# EAGLE design display (EAGLE 9.6.2)
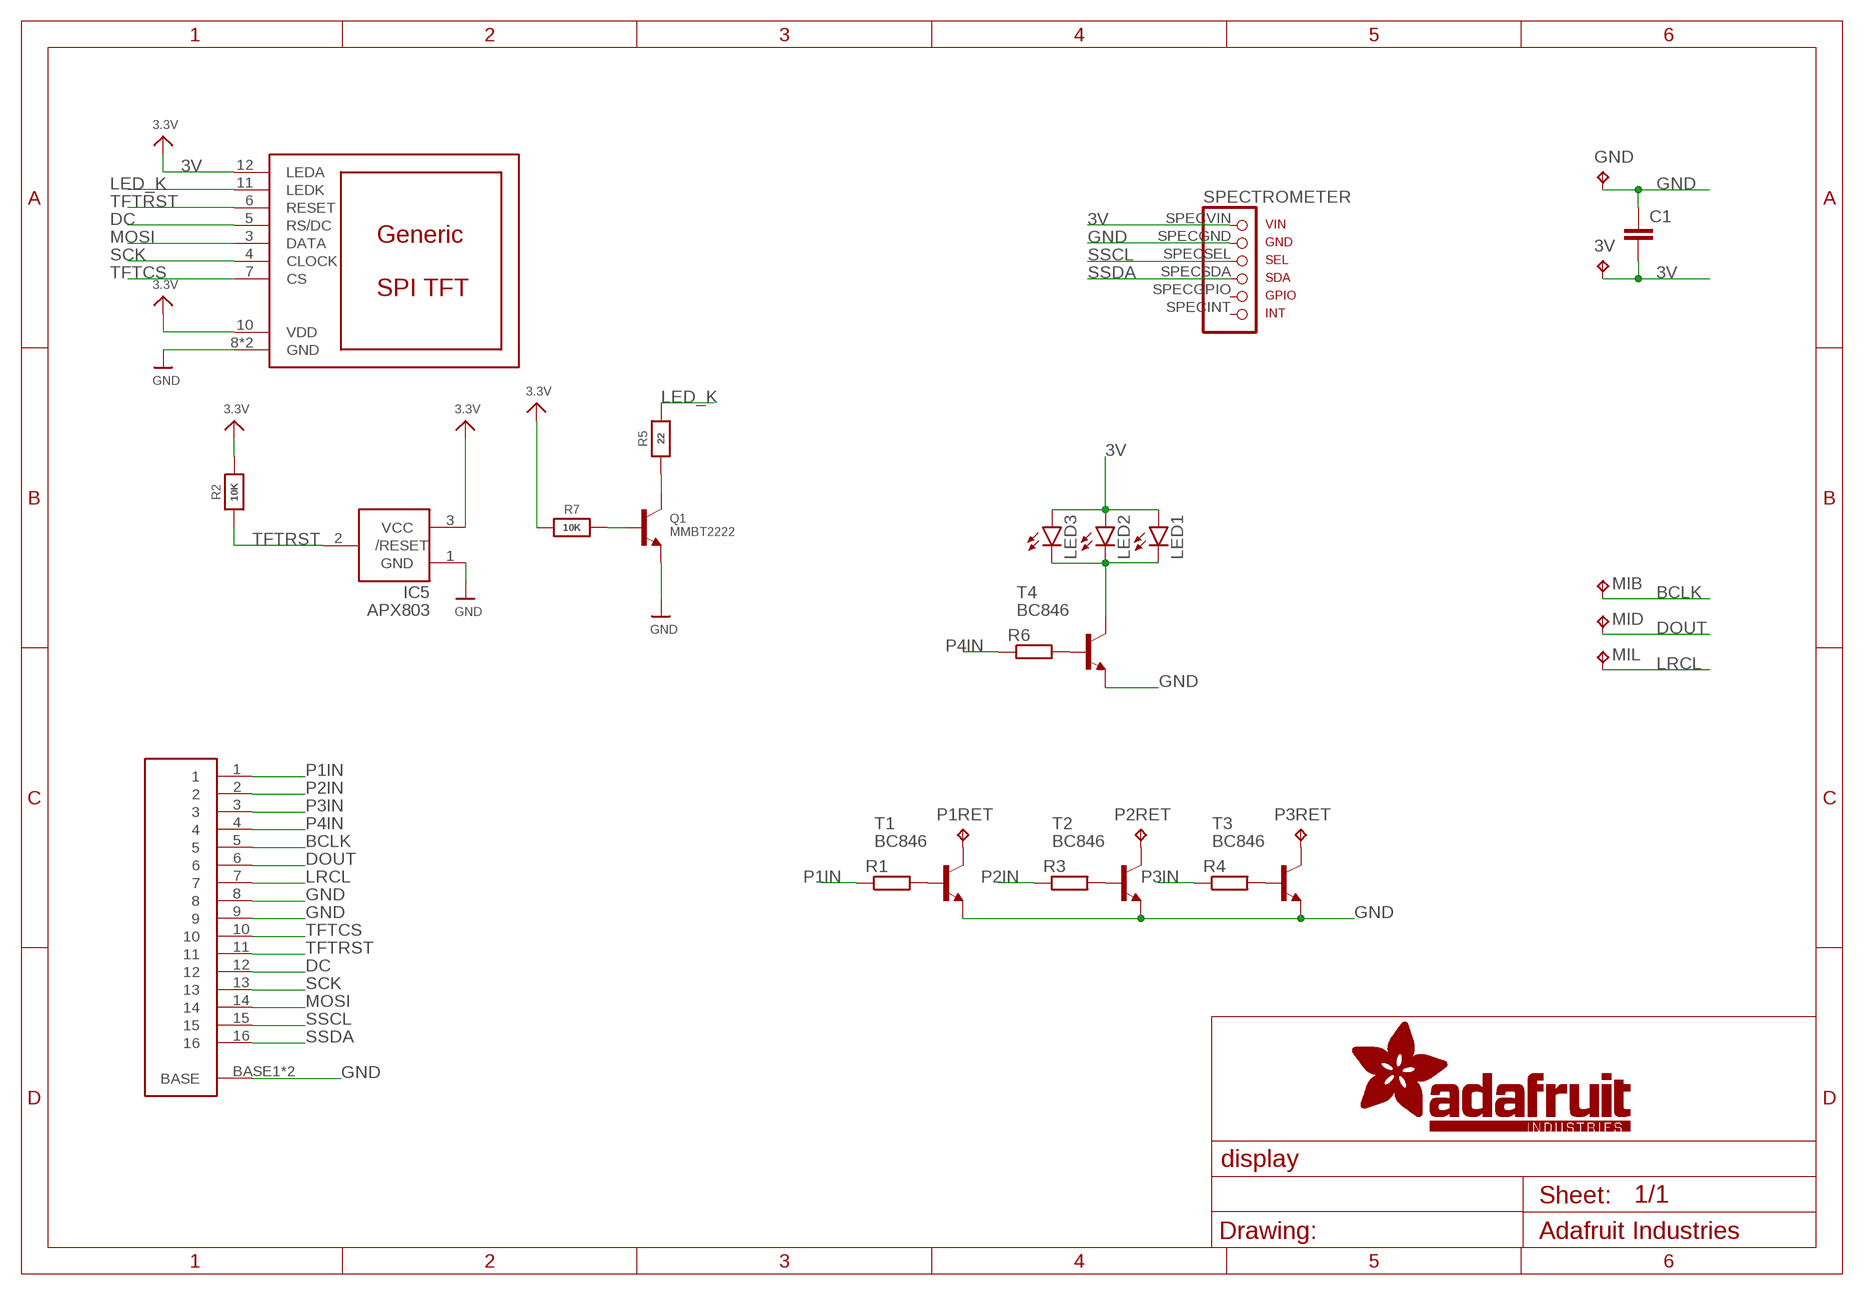
[diagram p0: schematic, sheet 1]

## Parts
3V  TPTP20R  [TP20R]
C1  C-EUC0805  [C0805]
DISP1  DISP_LCD_GENERIC_SPI_1.14IN_240X135_WRAPUNDER  [TFT_1.14IN_240X135_WRAPUNDER]
GND  TPTP20R  [TP20R]
IC5  APX803  AXP083-SAG  [SOT23]
LED1  LED3MM  [LED3MM]
LED2  LED3MM  [LED3MM]
LED3  LED3MM  [LED3MM]
MIB  TPTP10R  [TP10R]
MID  TPTP10R  [TP10R]
MIL  TPTP10R  [TP10R]
P1RET  TPTP10R  [TP10R]
P2RET  TPTP10R  [TP10R]
P3RET  TPTP10R  [TP10R]
Q1  MMBT2222  TRANSISTOR_NPNWIDE  [SOT23-WIDE]
R1  R-EU_R0805  [R0805]
R2  10K  RESISTOR_0603_NOOUT  [0603-NO]
R3  R-EU_R0805  [R0805]
R4  R-EU_R0805  [R0805]
R5  22  RESISTOR_0603_NOOUT  [0603-NO]
R6  R-EU_R0805  [R0805]
R7  10K  RESISTOR_0603_NOOUT  [0603-NO]
T1  BC846  [SOT23]
T2  BC846  [SOT23]
T3  BC846  [SOT23]
T4  BC846  [SOT23]
U$2  SPECTROMETER  [SPECTROMETER]
U$3  16PINFFC  [16PINFFC]

## Nets
3V [thick]: 3V.TP C1.2 DISP1.10(VDD) DISP1.12(LEDA) IC5.3(VCC) LED1.A LED2.A LED3.A R2.2 R7.1 U$2.SPECVIN ; supply symbol labelled 3.3V
BCLK: MIB.TP U$3.5
DC: DISP1.5(RS/DC) U$3.12
DOUT: MID.TP U$3.6
GND [thick]: C1.1 DISP1.8(GND) DISP1.13(GND) GND.TP IC5.1(GND) Q1.2(E) T1.2(E) T2.2(E) T3.2(E) T4.2(E) U$2.SPECGND U$3.8 U$3.9 U$3.BASE1(BASE) U$3.BASE2(BASE)
LED_K: DISP1.11(LEDK) R5.2
LRCL: MIL.TP U$3.7
MOSI: DISP1.3(DATA) U$3.14
N$1: Q1.1(B) R7.2
N$4: R1.2 T1.1(B)
N$5: Q1.3(C) R5.1
N$6: R3.2 T2.1(B)
N$7: R4.2 T3.1(B)
N$8: P1RET.TP T1.3(C)
N$9: P2RET.TP T2.3(C)
N$10: P3RET.TP T3.3(C)
N$14: R6.2 T4.1(B)
P1IN: R1.1 U$3.1
P2IN: R3.1 U$3.2
P3IN: R4.1 U$3.3
P4IN: R6.1 U$3.4
PWM4: LED1.K(C) LED2.K(C) LED3.K(C) T4.3(C)
SCK: DISP1.4(CLOCK) U$3.13
SSCL: U$2.SPECSEL U$3.15
SSDA: U$2.SPECSDA U$3.16
TFTCS: DISP1.7(CS) U$3.10
TFTRST: DISP1.6(RESET) IC5.2(/RESET) R2.1 U$3.11
Unconnected: U$2.SPECGPIO U$2.SPECINT

## Library data of the parts
3V GND MIB MID MIL P1RET P2RET P3RET = testpad:TP: Test pad
C1 = resistor:C-EU: CAPACITOR, European symbol
DISP1 = microbuilder:DISP_LCD_GENERIC_SPI
IC5 = adafruit:AXP083
LED1-LED3 = led:LED: LED OSRAM: - CHIPLED LG R971, LG N971, LY N971, LG Q971, LY Q971, LO R971, LY R971 LH N974, LH R974 LS Q976, LO Q976, LY Q976 LO Q996 - Hyper CHIPLED LW Q18S LB Q993, LB Q99A, LB R99A - SideLED LS A670, LO A670, LY A670, LG A670, LP A670 LB A673, LV A673, LT A673, LW A673 LH A674 LY A675 LS A676, LA A676, LO A676, LY A676, LW A676 LS A679, LY A679, LG A679 - Hyper Micro SIDELED® LS Y876, LA Y876, LO Y876, LY Y876 LT Y87S - SmartLED LW L88C, LW L88S LB L89C, LB L89S, LG L890 LS L89K, LO L89K, LY L89K LS L896, LA L896, LO L896, LY L896 - TOPLED LS T670, LO T670, LY T670, LG T670, LP T670 LSG T670, LSP T670, LSY T670, LOP T670, LYG T670 LG T671, LOG T671, LSG T671 LB T673, LV T673, LT T673, LW T673 LH T674 LS T676, LA T676, LO T676, LY T676, LB T676, LH T676, LSB T676, LW T676 LB T67C, LV T67C, LT T67C, LS T67K, LO T67K, LY T67K, LW E67C LS E67B, LA E67B, LO E67B, LY E67B, LB E67C, LV E67C, LT E67C LW T67C LS T679, LY T679, LG T679 LS T770, LO T770, LY T770, LG T770, LP T770 LB T773, LV T773, LT T773, LW T773 LH T774 LS E675, LA E675, LY E675, LS T675 LS T776, LA T776, LO T776, LY T776, LB T776 LHGB T686 LT T68C, LB T68C - Hyper Mini TOPLED® LB M676 - Mini TOPLED Santana® LG M470 LS M47K, LO M47K, LY M47K Source: http://www.osram.convergy.de LUXEON: - LUMILED® LXK2-PW12-R00, LXK2-PW12-S00, LXK2-PW14-U00, LXK2-PW14-V00 LXK2-PM12-R00, LXK2-PM12-S00, LXK2-PM14-U00 LXK2-PE12-Q00, LXK2-PE12-R00, LXK2-PE12-S00, LXK2-PE14-T00, LXK2-PE14-U00 LXK2-PB12-K00, LXK2-PB12-L00, LXK2-PB12-M00, LXK2-PB14-N00, LXK2-PB14-P00, LXK2-PB14-Q00 LXK2-PR12-L00, LXK2-PR12-M00, LXK2-PR14-Q00, LXK2-PR14-R00 LXK2-PD12-Q00, LXK2-PD12-R00, LXK2-PD12-S00 LXK2-PH12-R00, LXK2-PH12-S00 LXK2-PL12-P00, LXK2-PL12-Q00, LXK2-PL12-R00 Source: www.luxeon.com KINGBRIGHT: KA-3528ASYC Source: www.kingbright.com
Q1 = microbuilder:TRANSISTOR_NPN: NPN Transistor Transistor (NPN) 500mA 45V - BC817 [Digikey: 568-1631-1-ND] Transistor (NPN) 500mA 45V - BC817,215 [Mouser: 771-BC817-T/R] SOT23-R - SOT23 footprint optimised for use with solder paste and reflow ovens. SOT23-W - SOT23 footprint optimised for hand-soldering (larger pads).
R1 R3 R4 R6 = resistor:R-EU_: RESISTOR, European symbol
R2 R5 R7 = microbuilder:RESISTOR: Resistors For new designs, use the packages preceded by an '_' character since they are more reliable: The following footprints should be used on most boards: _0402 - Standard footprint for regular board layouts _0603 - Standard footprint for regular board layouts _0805 - Standard footprint for regular board layouts _1206 - Standard footprint for regular board layouts For extremely tight-pitch boards where space is at a premium, the following 'micro-pitch' footprints can be used (smaller pads, no silkscreen outline, etc.): _0402MP - Micro-pitch footprint for very dense/compact boards _0603MP - Micro-pitch footprint for very dense/compact boards _0805MP - Micro-pitch footprint for very dense/compact boards _1206MP - Micro-pitch footprint for very dense/compact boards
T1-T4 = transistor:BC846: NPN TRANSISTOR
U$2 = general:SPECTROMETER
U$3 = general:16PINFFC

## Net classes
1 thick: width 0.305 mm

## Board
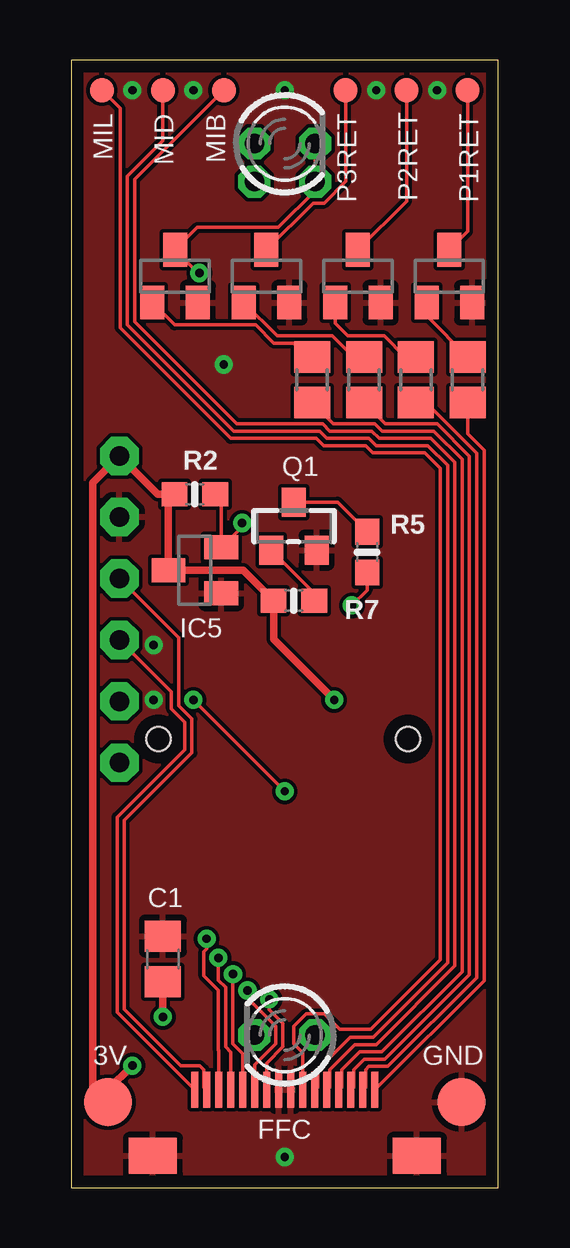
[diagram p1: board, top side]
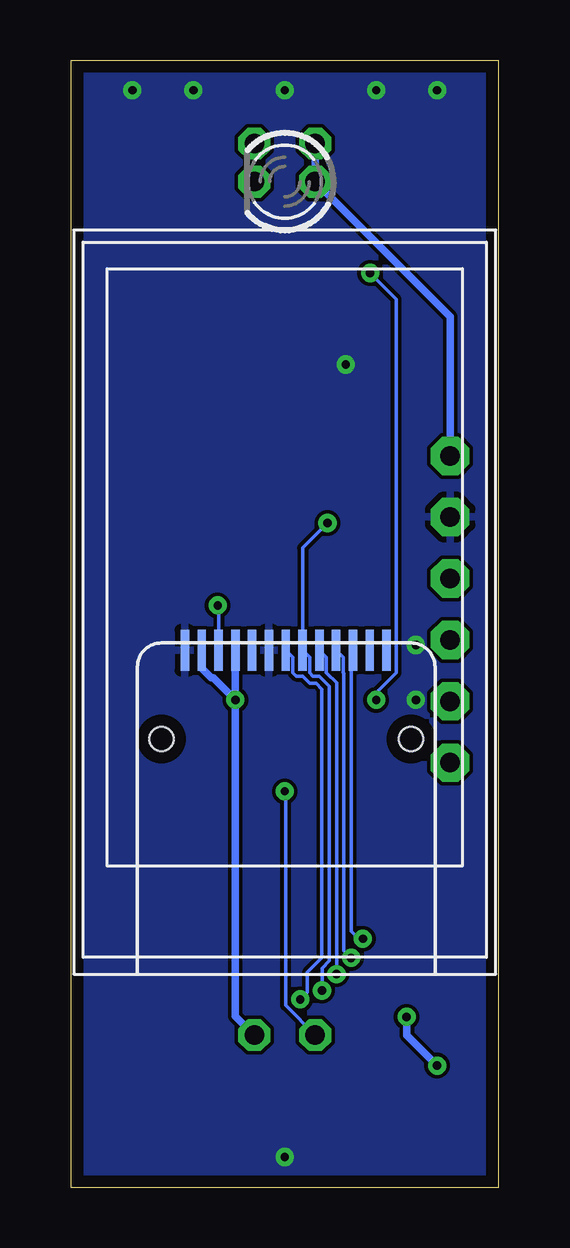
[diagram p2: board, bottom side, seen from below]

Size 17.78 x 46.98 mm. Coordinates in mm from the lower left corner, seen from the top.
Outline: 0,0 17.78,0 17.78,46.98 0,46.98 0,0
Copper layers (1*16): Top 0.035mm / dielectric 1.5mm / Bottom 0.035mm
Design rules "default *": minimum track width 6mil, minimum drill 0.35mm, track to track 6mil, track to pad 6mil, pad to pad 6mil, via to via 6mil, smd to smd 6mil, copper to edge 20mil, drill to drill 6mil, minimum pad ring 10mil, minimum via ring 8mil, stop-mask expansion 4mil, vias tented up to drill 0mil, thermal gap 10mil

### Footprints (pad centres in the part's own frame; a part is rotated, then mirrored left to right if it is on the bottom)
TP20R = smd 2 x 2: TP 0,0
C0805 = smd 1.3 x 1.5: 1 -0.95,0; 2 0.95,0
TFT_1.14IN_240X135_WRAPUNDER = smd 0.35 x 1.7: 1 4.24,13.5; 2 3.54,13.5; 3 2.84,13.5; 4 2.14,13.5; 5 1.44,13.5; 6 0.74,13.5; 7 0.04,13.5; 8 -0.66,13.5; 9 -1.36,13.5; 10 -2.06,13.5; 11 -2.76,13.5; 12 -3.46,13.5; 13 -4.16,13.5 | hole 1: -5.14,9.8; 5.26,9.8
SOT23 = smd 1 x 1.4: 1 -0.95,-1.1; 2 0.95,-1.1; 3 0,1.1
LED3MM = drill 0.813 octagon: A -1.27,0; K 1.27,0
TP10R = smd 1 x 1: TP 0,0
SOT23-WIDE = smd 1 x 1.2: 1 -0.95,-1; 2 0.95,-1; 3 0,1
R0805 = smd 1.3 x 1.5: 1 -0.95,0; 2 0.95,0
0603-NO = smd 1.075 x 1: 1 -0.85,0; 2 0.85,0
SPECTROMETER = drill 0.813 pad 1.6 octagon: SPECGND 2.54,0; SPECGPIO 10.22,0; SPECINT 12.78,0; SPECSDA 7.66,0; SPECSEL 5.1,0; SPECVIN 0,0
16PINFFC = smd 0.3 x 1.5: 1 -3.75,0; 2 -3.25,0; 3 -2.75,0; 4 -2.25,0; 5 -1.75,0; 6 -1.25,0; 7 -0.75,0; 8 -0.25,0; 9 0.25,0; 10 0.75,0; 11 1.25,0; 12 1.75,0; 13 2.25,0; 14 2.75,0; 15 3.25,0; 16 3.75,0 | smd 2 x 1.5: BASE1 -5.5,2.75; BASE2 5.5,2.75

### Placement (x,y rotation side)
3V  1.52,3.56 0 top
C1  3.81,9.53 270 top
DISP1  8.89,8.89 0 bottom
GND  16.26,3.56 0 top
IC5  5.14,25.72 90 top
LED1  8.89,41.91 180 bottom
LED2  8.89,43.5 0 top
LED3  8.89,6.35 180 top
MIB  6.35,45.72 0 top
MID  3.81,45.72 0 top
MIL  1.27,45.72 0 top
P1RET  16.51,45.72 0 top
P2RET  13.97,45.72 0 top
P3RET  11.43,45.72 0 top
Q1  9.27,27.56 0 top
R1  16.51,33.66 90 top
R2  5.14,28.89 180 top
R3  14.35,33.66 90 top
R4  12.19,33.66 90 top
R5  12.32,26.48 270 top
R6  10.03,33.66 90 top
R7  9.27,24.45 0 top
T1  15.75,37.97 0 top
T2  11.94,37.97 0 top
T3  8.13,37.97 0 top
T4  4.32,37.97 0 top
U$2  2,30.48 270 bottom
U$3  8.89,4.06 180 top

### Tracks (layer width: path | path; a pad name or v marks a point on that pad's centre or on a via)
3V  (via drill 0.35)
  Top 0.305: v10.95,20.32 8.42,22.85 R7.1 7.15,25.72 IC5.3 4.04,28.64 R2.2 3.59,28.89 U$2.SPECVIN 0.9,29.38 0.9,4.18 3V.TP 1.52,4.06 v2.54,5.08 | C1.2 v3.81,7.11
  Bottom 0.305: DISP1.10 v10.95,20.32 | v10.95,20.32 10.95,7.14 LED3.A | v10.95,20.32 11.87,21.23 11.95,21.23 12.35,21.63 DISP1.12 | U$2.SPECVIN 2,36.29 LED1.A LED2.A | v3.81,7.11 3.81,6.35 v2.54,5.08
BCLK
  Top 0.152: U$3.5 10.76,4.18 10.76,4.91 11.81,5.96 12.7,5.96 15.98,9.23 15.98,30.22 14.98,31.22 12.82,31.22 12.51,31.52 10.77,31.52 10.46,31.83 6.89,31.83 2.64,36.08 2.64,42.01 MIB.TP
DC  (via drill 0.35)
  Top 0.152: U$3.12 7.14,5.57 6.73,5.98 v6.73,8.89
  Bottom 0.152: DISP1.5 7.15,22.09 7.15,21.45 6.73,21.02 v6.73,8.89
DOUT
  Top 0.152: U$3.6 10.26,4.18 10.26,4.91 11.62,6.26 12.57,6.26 15.67,9.36 15.67,30.1 14.86,30.91 12.69,30.91 12.39,31.22 10.64,31.22 10.34,31.52 6.76,31.52 2.33,35.95 2.33,42.14 3.81,43.61 MID.TP
GND  (via drill 0.35)
  other vias: 2.54,45.72 5.08,45.72 6.35,34.29 12.7,45.72 15.24,45.72 3.43,22.61 3.43,20.32 8.89,45.72 8.89,1.27
  pour Top: -1.27,-1.27 -1.27,48.26 19.05,48.26 19.05,-1.27
  pour Bottom: -2.54,-2.54 -2.54,49.53 20.32,49.53 20.32,-2.54
LED_K  (via drill 0.35)
  Top 0.152: R5.2 12.32,24.89 v11.68,24.26
  Bottom 0.152: v11.68,24.26 11.65,24.22 DISP1.11
LRCL
  Top 0.152: U$3.7 9.64,5.61 9.27,5.98 9.27,6.72 9.79,7.24 10.53,7.24 11.18,6.58 12.46,6.58 15.37,9.49 15.37,29.97 14.73,30.61 12.57,30.61 12.26,30.91 10.52,30.91 10.21,31.22 6.64,31.22 2.03,35.83 2.03,44.96 MIL.TP
MOSI  (via drill 0.35)
  Top 0.152: U$3.14 6.14,5.71 6.12,5.73 6.12,8.21 5.52,8.81 5.52,9.82 5.64,9.94 v5.64,10.37
  Bottom 0.152: v5.64,10.37 5.82,10.37 6.12,10.67 6.12,22.32 DISP1.3
N$1
  Top 0.152: Q1.1 10.12,24.76 R7.2
N$4
  Top 0.152: R1.2 14.8,36.32 T1.1
N$5
  Top 0.152: Q1.3 11.09,28.56 R5.1
N$6
  Top 0.152: R3.2 13.91,34.6 13.04,35.48 11.51,35.48 10.99,36 T2.1
N$7
  Top 0.152: R4.2 11.76,34.6 10.88,35.48 8.57,35.48 T3.1
N$8
  Top 0.152: T1.3 16.51,39.84 P1RET.TP
N$9
  Top 0.152: T2.3 13.97,41.1 P2RET.TP
N$10
  Top 0.152: T3.3 10.08,41.02 10.53,41.02 11.43,41.92 P3RET.TP
N$14
  Top 0.152: R6.2 9.85,34.6 9.27,35.18 8.44,35.18 7.68,35.94 4.3,35.94 T4.1
P1IN
  Top 0.152: U$3.1 17.2,8.62 17.2,30.73 16.51,31.41 R1.1
P2IN
  Top 0.152: U$3.2 12.26,4.18 12.26,4.91 12.39,5.04 13.19,5.04 16.89,8.75 16.89,30.6 14.79,32.7 R3.1
P3IN
  Top 0.152: U$3.3 11.76,4.18 11.76,4.91 12.2,5.35 13.06,5.35 16.59,8.87 16.59,30.47 15.23,31.83 13.07,31.83 R4.1
P4IN
  Top 0.152: U$3.4 11.26,4.18 11.26,4.91 12.01,5.65 12.94,5.65 16.28,9 16.28,30.35 15.11,31.52 12.94,31.52 12.64,31.83 10.91,31.83 R6.1
PWM4  (via drill 0.35)
  Top 0.152: v8.89,16.51 v5.08,20.32 | v5.33,38.1 5.29,38.1 T4.3 5.25,40 8.63,40 10.16,41.54 LED1.K LED2.K
  Bottom 0.152: LED3.K 8.85,7.59 8.85,16.47 v8.89,16.51 | v5.08,20.32 5.08,20.61 4.25,21.45 4.25,37.02 v5.33,38.1
SCK  (via drill 0.35)
  Top 0.152: U$3.13 6.64,5.64 6.43,5.86 6.43,8.34 6.12,8.64 v6.12,9.57
  Bottom 0.152: v6.12,9.57 6.43,9.87 6.43,21.42 6.45,21.45 6.45,22.09 DISP1.4
SSCL
  Top 0.152: U$3.15 5.52,4.18 5.52,4.91 5.35,5.08 4.55,5.08 2.21,7.42 2.21,15.3 5.02,18.11 5.02,19.52 4.47,20.07 4.47,22.91 U$2.SPECSEL
SSDA
  Top 0.152: U$3.16 1.91,7.3 1.91,15.43 4.71,18.24 4.71,19.4 4.17,19.94 4.17,20.65 U$2.SPECSDA
TFTCS  (via drill 0.35)
  Top 0.152: v8.25,7.84 8.25,7.41 8.81,6.84 8.81,5.86 8.14,5.18 U$3.10
  Bottom 0.152: DISP1.7 8.55,22.09 8.55,21.45 8.42,21.31 8.15,21.31 7.85,21.01 7.58,21.01 7.34,20.77 7.34,9.57 7.95,8.97 7.95,8.14 v8.25,7.84
TFTRST  (via drill 0.35)
  Top 0.152: R2.1 6.24,28.64 IC5.2 7.11,27.54 v7.11,27.69 | v7.34,8.21 7.34,7.89 8.51,6.72 8.51,5.98 7.64,5.11 U$3.11
  Bottom 0.152: v7.34,8.21 7.34,9.14 7.04,9.44 7.04,20.9 7.45,21.31 7.72,21.31 7.85,21.45 7.85,22.09 DISP1.6 8.15,26.65 v7.11,27.69

### Text on the board
tNames: FFC